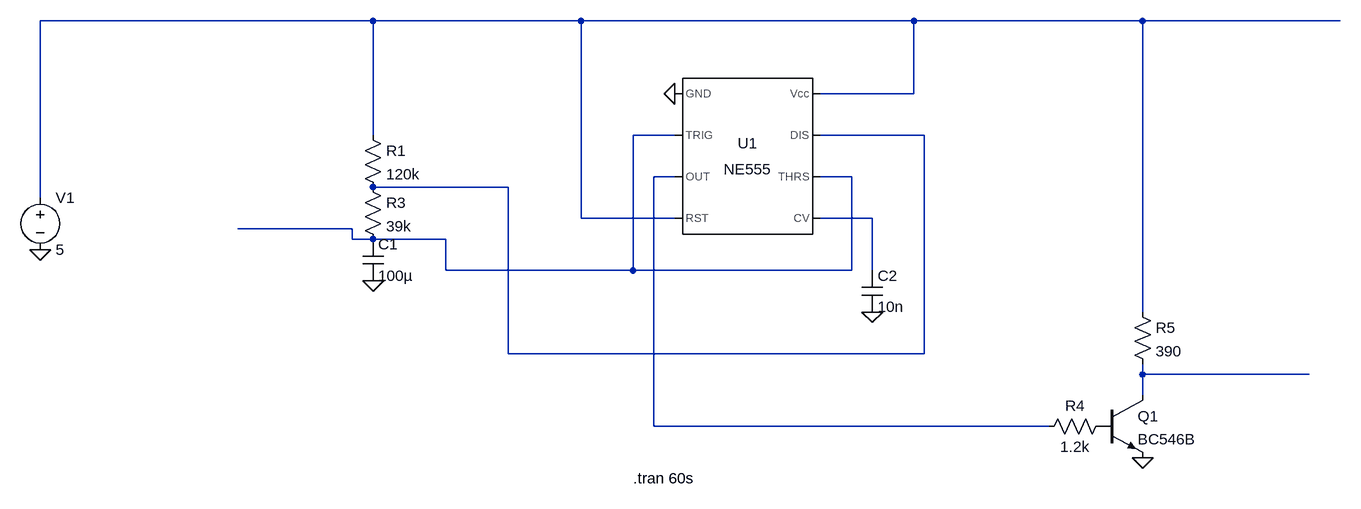
[diagram p0: schematic board_15mA.asc]
board_15mA.asc, the LTspice schematic file:
Version 4
SHEET 1 1860 816
WIRE 32 64 -480 64
WIRE 352 64 32 64
WIRE 864 64 352 64
WIRE 1216 64 864 64
WIRE 1520 64 1216 64
WIRE 864 176 864 64
WIRE 864 176 720 176
WIRE 32 240 32 64
WIRE 496 240 432 240
WIRE 880 240 720 240
WIRE 496 304 464 304
WIRE 768 304 720 304
WIRE 240 320 32 320
WIRE -480 336 -480 64
WIRE 352 368 352 64
WIRE 496 368 352 368
WIRE 800 368 720 368
WIRE 0 384 -176 384
WIRE 0 400 0 384
WIRE 32 400 0 400
WIRE 144 400 32 400
WIRE 144 448 144 400
WIRE 432 448 432 240
WIRE 432 448 144 448
WIRE 768 448 768 304
WIRE 768 448 432 448
WIRE 800 448 800 368
WIRE 1216 512 1216 64
WIRE 240 576 240 320
WIRE 880 576 880 240
WIRE 880 576 240 576
WIRE 1216 608 1216 592
WIRE 1472 608 1216 608
WIRE 1216 640 1216 608
WIRE 464 688 464 304
WIRE 1072 688 464 688
FLAG 800 512 0
FLAG -480 416 0
FLAG 496 176 0
FLAG 1216 736 0
FLAG 32 464 0
SYMBOL Misc/NE555 608 272 R0
SYMATTR InstName U1
SYMBOL Res 16 224 R0
SYMATTR InstName R1
SYMATTR Value 120k
SYMBOL Res 16 304 R0
SYMATTR InstName R3
SYMATTR Value 39k
SYMBOL Cap 16 400 R0
SYMATTR InstName C1
SYMATTR Value 100µ
SYMBOL Voltage -480 320 R0
SYMATTR InstName V1
SYMATTR Value 5
SYMBOL Cap 784 448 R0
SYMATTR InstName C2
SYMATTR Value 10n
SYMBOL npn 1152 640 R0
SYMATTR InstName Q1
SYMATTR Value BC546B
SYMBOL Res 1168 672 R90
WINDOW 0 0 56 VBottom 2
WINDOW 3 32 56 VTop 2
SYMATTR InstName R4
SYMATTR Value 1.2k
SYMBOL Res 1200 496 R0
SYMATTR InstName R5
SYMATTR Value 390
TEXT 432 768 Left 2 !.tran 60s

The netlist it stands for:
* board_15mA.asc
XU1 0 N002 N004 N001 N005 N002 N003 N001 NE555  ; pins GND TRIG OUT RST CV THRS DIS Vcc
R1 N001 N003 120k
R3 N003 N002 39k
C1 N002 0 100µ
V1 N001 0 5
C2 N005 0 10n
Q1 N006 P001 0 0 BC546B
R4 P001 N004 1.2k
R5 N001 N006 390
.model NPN NPN
.model PNP PNP
.lib standard.bjt
.tran 60s
.lib NE555.sub
.backanno
.end